# Altium project USB_C_programmer_board.PrjPcb
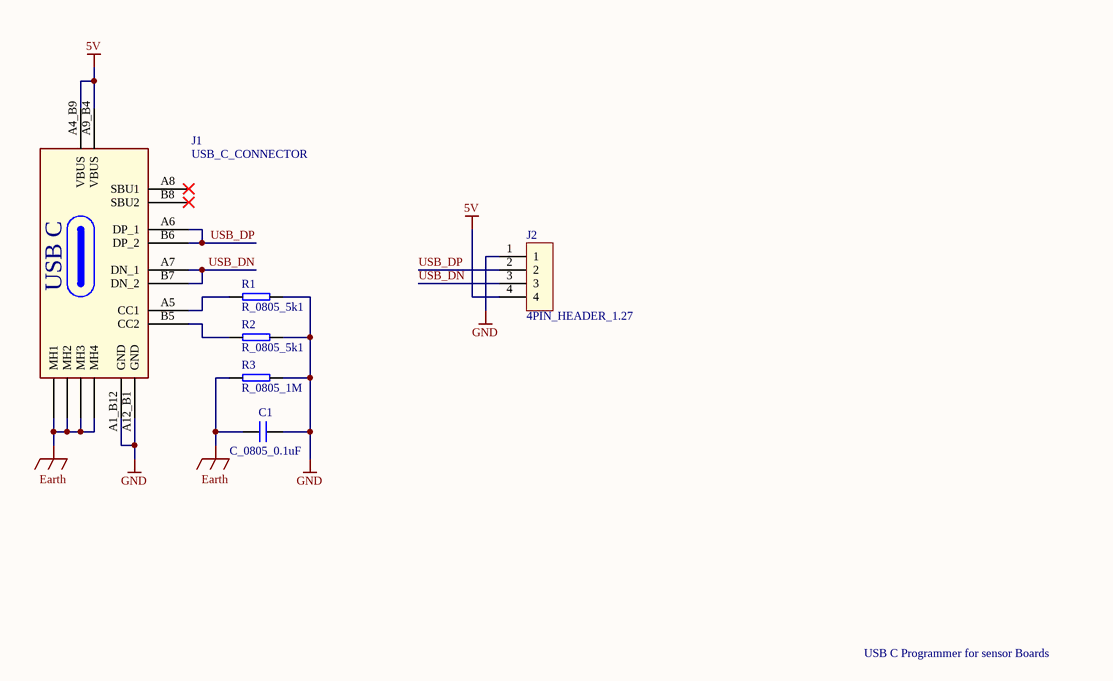
[diagram p0: USB_C_programmer_1.SchDoc]
Author: Petar Barakov; Revision: Rev 1.0
1 sheet, 6 parts. Net scope: global (net labels, ports and power ports of the same name join across sheets).
Board file: USB_C_programmer_board.PcbDoc

## Sheet USB_C_programmer_1.SchDoc
size A4; SheetNumber: 1; SheetTotal: 1

### Parts
C1  C_0805_0.1uF  [CAP_0805]
J1  USB_C_CONNECTOR  [USB_C_CONNECTOR-Footprint-1]
J2  4PIN_HEADER_1.27  [4PIN_HEADER_1.27-Footprint-1]
R1  R_0805_5k1  [0805_RES]
R2  R_0805_5k1  [0805_RES]
R3  R_0805_1M  [0805_RES]

### Nets
5V: J1.A4_B9(VBUS) J1.A9_B4(VBUS) J2.4
Earth: C1.1 J1.MH1 J1.MH2 J1.MH3 J1.MH4 R3.2
GND: C1.2 J1.A1_B12(GND) J1.A12_B1(GND) J2.1 R1.1 R2.1 R3.1
USB_DN: J1.A7(DN_1) J1.B7(DN_2) J2.3
USB_DP: J1.A6(DP_1) J1.B6(DP_2) J2.2
NetJ1_A5: J1.A5(CC1) R1.2
NetJ1_B5: J1.B5(CC2) R2.2

Not connected (* = marked no-connect by the designer): J1 A8(SBU1)* B8(SBU2)*

### Notes on the sheet
- USB C Programmer for sensor Boards
- (in symbol CMP-00013-4) USB C

### Library data of the parts
C1 = CMP-00002-4: Order Code: 581-08051C104KAT4A; JLC Part Number: C28233; Distributor: Mouser
J1 = CMP-00013-4: USB2.0, Type C, Top Mount, Ch 1.68MM, Dual Row SMT / Tap/rl; Order Code: 538-217179-0001; Distributor: Mouser; JLC Part Number: C2831450
J2 = CMP-00049-2: Order Code: 855-M50-3530442; Distributor: Mouser
R1 R2 = CMP-00014-4: Order Code: 71-CRCW0805-5.1K-E3; JLC Part Number: C27834; Distributor: Mouser
R3 = CMP-00037-4: Order Code: 667-ERJ-P06J105V; JLC Part Number: C131391; Distributor: Mouser